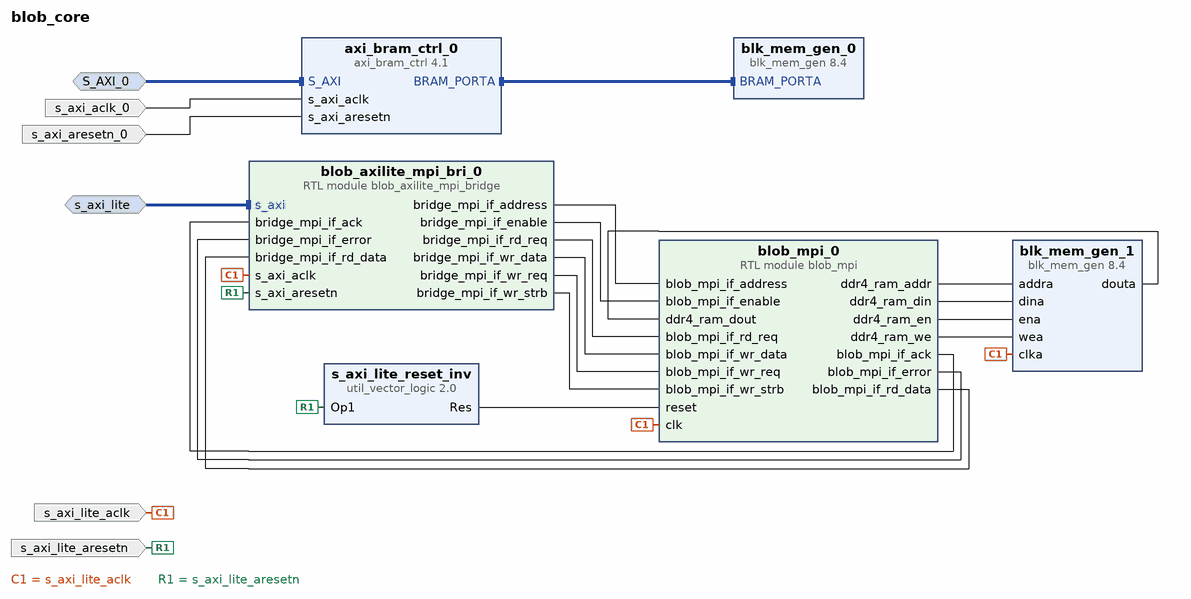
[diagram p0: block diagram of the top level]
# Vivado block design blob_core, xcvu9p-flgb2104-2-e, Vivado 2023.1
create_bd_design blob_core

create_bd_intf_port -mode Slave -vlnv xilinx.com:interface:aximm_rtl:1.0 S_AXI_0
set_property -dict [list \
  CONFIG.ADDR_WIDTH 15 \
  CONFIG.ARUSER_WIDTH 0 \
  CONFIG.AWUSER_WIDTH 0 \
  CONFIG.BUSER_WIDTH 0 \
  CONFIG.DATA_WIDTH 256 \
  CONFIG.HAS_BRESP 1 \
  CONFIG.HAS_BURST 1 \
  CONFIG.HAS_CACHE 1 \
  CONFIG.HAS_LOCK 1 \
  CONFIG.HAS_PROT 1 \
  CONFIG.HAS_QOS 0 \
  CONFIG.HAS_REGION 0 \
  CONFIG.HAS_RRESP 1 \
  CONFIG.HAS_WSTRB 1 \
  CONFIG.ID_WIDTH 0 \
  CONFIG.MAX_BURST_LENGTH 256 \
  CONFIG.NUM_READ_OUTSTANDING 2 \
  CONFIG.NUM_READ_THREADS 1 \
  CONFIG.NUM_WRITE_OUTSTANDING 2 \
  CONFIG.NUM_WRITE_THREADS 1 \
  CONFIG.PROTOCOL AXI4 \
  CONFIG.READ_WRITE_MODE READ_WRITE \
  CONFIG.RUSER_BITS_PER_BYTE 0 \
  CONFIG.RUSER_WIDTH 0 \
  CONFIG.SUPPORTS_NARROW_BURST 1 \
  CONFIG.WUSER_BITS_PER_BYTE 0 \
  CONFIG.WUSER_WIDTH 0 \
] [get_bd_intf_ports S_AXI_0]
create_bd_intf_port -mode Slave -vlnv xilinx.com:interface:aximm_rtl:1.0 s_axi_lite
set_property -dict [list \
  CONFIG.ADDR_WIDTH 32 \
  CONFIG.ARUSER_WIDTH 0 \
  CONFIG.AWUSER_WIDTH 0 \
  CONFIG.BUSER_WIDTH 0 \
  CONFIG.DATA_WIDTH 32 \
  CONFIG.HAS_BRESP 1 \
  CONFIG.HAS_BURST 0 \
  CONFIG.HAS_CACHE 0 \
  CONFIG.HAS_LOCK 0 \
  CONFIG.HAS_PROT 1 \
  CONFIG.HAS_QOS 0 \
  CONFIG.HAS_REGION 0 \
  CONFIG.HAS_RRESP 1 \
  CONFIG.HAS_WSTRB 1 \
  CONFIG.ID_WIDTH 0 \
  CONFIG.MAX_BURST_LENGTH 1 \
  CONFIG.NUM_READ_OUTSTANDING 1 \
  CONFIG.NUM_READ_THREADS 1 \
  CONFIG.NUM_WRITE_OUTSTANDING 1 \
  CONFIG.NUM_WRITE_THREADS 1 \
  CONFIG.PROTOCOL AXI4LITE \
  CONFIG.READ_WRITE_MODE READ_WRITE \
  CONFIG.RUSER_BITS_PER_BYTE 0 \
  CONFIG.RUSER_WIDTH 0 \
  CONFIG.SUPPORTS_NARROW_BURST 0 \
  CONFIG.WUSER_BITS_PER_BYTE 0 \
  CONFIG.WUSER_WIDTH 0 \
] [get_bd_intf_ports s_axi_lite]
create_bd_port -dir I -type clk s_axi_aclk_0
create_bd_port -dir I -type rst s_axi_aresetn_0
create_bd_port -dir I -type rst s_axi_lite_aresetn
create_bd_port -dir I -type clk s_axi_lite_aclk
set_property -dict {CONFIG.ASSOCIATED_BUSIF s_axi_lite CONFIG.ASSOCIATED_RESET s_axi_lite_aresetn} [get_bd_ports s_axi_lite_aclk]

create_bd_cell -type ip -vlnv xilinx.com:ip:axi_bram_ctrl:4.1 axi_bram_ctrl_0
set_property -dict {CONFIG.DATA_WIDTH 256 CONFIG.SINGLE_PORT_BRAM 1} [get_bd_cells axi_bram_ctrl_0]
create_bd_cell -type ip -vlnv xilinx.com:ip:blk_mem_gen:8.4 blk_mem_gen_0
create_bd_cell -type module -reference blob_mpi blob_mpi_0
create_bd_cell -type module -reference blob_axilite_mpi_bridge blob_axilite_mpi_bri_0
create_bd_cell -type ip -vlnv xilinx.com:ip:util_vector_logic:2.0 s_axi_lite_reset_inv
set_property -dict {CONFIG.C_OPERATION not CONFIG.C_SIZE 1} [get_bd_cells s_axi_lite_reset_inv]
create_bd_cell -type ip -vlnv xilinx.com:ip:blk_mem_gen:8.4 blk_mem_gen_1
set_property -dict [list \
  CONFIG.Byte_Size 8 \
  CONFIG.PRIM_type_to_Implement URAM \
  CONFIG.Use_Byte_Write_Enable true \
  CONFIG.Write_Depth_A 128 \
  CONFIG.Write_Width_A 800 \
  CONFIG.use_bram_block Stand_Alone \
] [get_bd_cells blk_mem_gen_1]

# ---- connections ----

connect_bd_intf_net -intf_net S_AXI_0_1 [get_bd_intf_ports S_AXI_0] [get_bd_intf_pins axi_bram_ctrl_0/S_AXI]
connect_bd_intf_net [get_bd_intf_pins axi_bram_ctrl_0/BRAM_PORTA] [get_bd_intf_pins blk_mem_gen_0/BRAM_PORTA]
connect_bd_intf_net -intf_net s_axi_1_1 [get_bd_intf_ports s_axi_lite] [get_bd_intf_pins blob_axilite_mpi_bri_0/s_axi]
connect_bd_net [get_bd_pins blk_mem_gen_1/douta] [get_bd_pins blob_mpi_0/ddr4_ram_dout]
connect_bd_net [get_bd_pins blob_axilite_mpi_bri_0/bridge_mpi_if_address] [get_bd_pins blob_mpi_0/blob_mpi_if_address]
connect_bd_net [get_bd_pins blob_axilite_mpi_bri_0/bridge_mpi_if_enable] [get_bd_pins blob_mpi_0/blob_mpi_if_enable]
connect_bd_net [get_bd_pins blob_axilite_mpi_bri_0/bridge_mpi_if_rd_req] [get_bd_pins blob_mpi_0/blob_mpi_if_rd_req]
connect_bd_net [get_bd_pins blob_axilite_mpi_bri_0/bridge_mpi_if_wr_data] [get_bd_pins blob_mpi_0/blob_mpi_if_wr_data]
connect_bd_net [get_bd_pins blob_axilite_mpi_bri_0/bridge_mpi_if_wr_req] [get_bd_pins blob_mpi_0/blob_mpi_if_wr_req]
connect_bd_net [get_bd_pins blob_axilite_mpi_bri_0/bridge_mpi_if_wr_strb] [get_bd_pins blob_mpi_0/blob_mpi_if_wr_strb]
connect_bd_net [get_bd_pins blob_mpi_0/blob_mpi_if_ack] [get_bd_pins blob_axilite_mpi_bri_0/bridge_mpi_if_ack]
connect_bd_net [get_bd_pins blob_mpi_0/blob_mpi_if_error] [get_bd_pins blob_axilite_mpi_bri_0/bridge_mpi_if_error]
connect_bd_net [get_bd_pins blob_mpi_0/blob_mpi_if_rd_data] [get_bd_pins blob_axilite_mpi_bri_0/bridge_mpi_if_rd_data]
connect_bd_net [get_bd_pins blob_mpi_0/ddr4_ram_addr] [get_bd_pins blk_mem_gen_1/addra]
connect_bd_net [get_bd_pins blob_mpi_0/ddr4_ram_din] [get_bd_pins blk_mem_gen_1/dina]
connect_bd_net [get_bd_pins blob_mpi_0/ddr4_ram_en] [get_bd_pins blk_mem_gen_1/ena]
connect_bd_net [get_bd_pins blob_mpi_0/ddr4_ram_we] [get_bd_pins blk_mem_gen_1/wea]
connect_bd_net -net s_axi_aclk_0_1 [get_bd_ports s_axi_aclk_0] [get_bd_pins axi_bram_ctrl_0/s_axi_aclk]
connect_bd_net -net s_axi_aclk_1_1 [get_bd_ports s_axi_lite_aclk] \
  [get_bd_pins blob_axilite_mpi_bri_0/s_axi_aclk] [get_bd_pins blob_mpi_0/clk] [get_bd_pins blk_mem_gen_1/clka]
connect_bd_net -net s_axi_aresetn_0_1 [get_bd_ports s_axi_aresetn_0] [get_bd_pins axi_bram_ctrl_0/s_axi_aresetn]
connect_bd_net -net s_axi_aresetn_1_1 [get_bd_ports s_axi_lite_aresetn] \
  [get_bd_pins blob_axilite_mpi_bri_0/s_axi_aresetn] [get_bd_pins s_axi_lite_reset_inv/Op1]
connect_bd_net -net s_axi_lite_reset [get_bd_pins s_axi_lite_reset_inv/Res] [get_bd_pins blob_mpi_0/reset]

# ---- address map ----
assign_bd_address -offset 0x0000 -range 4K -target_address_space [get_bd_addr_spaces S_AXI_0] [get_bd_addr_segs axi_bram_ctrl_0/S_AXI/Mem0]
assign_bd_address -offset 0x00000000 -range 64K -target_address_space [get_bd_addr_spaces s_axi_lite] [get_bd_addr_segs blob_axilite_mpi_bri_0/s_axi/reg0]

validate_bd_design
save_bd_design
